# Altium schematic sheet MCU.SchDoc
size A4
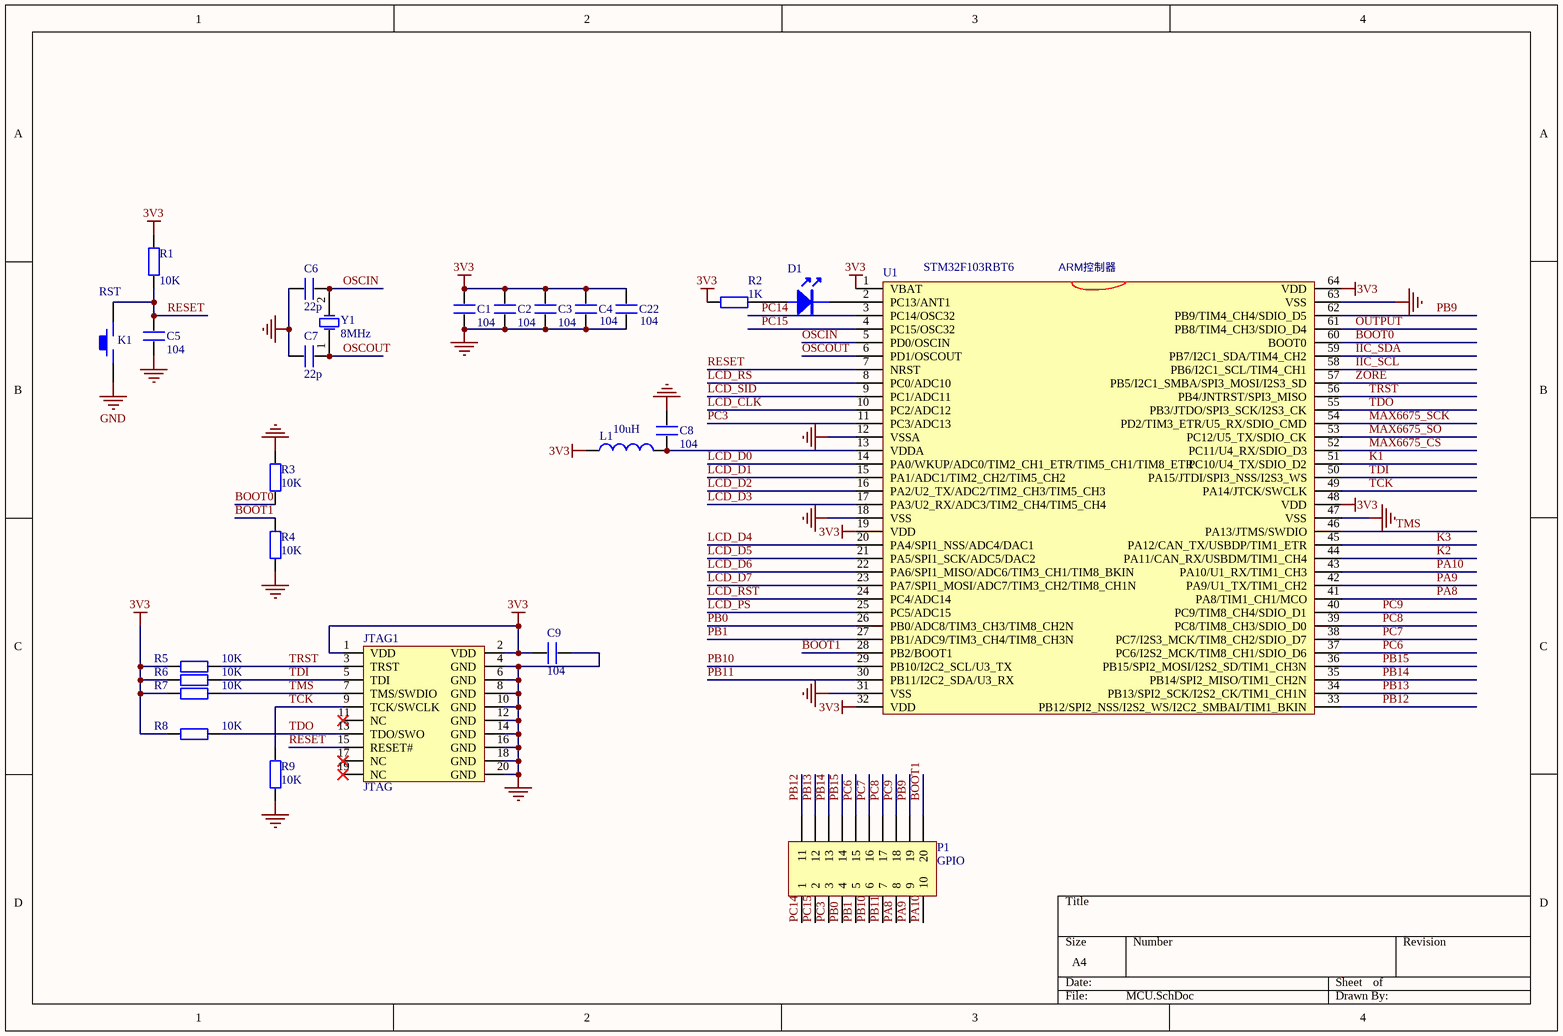
[diagram p0: MCU.SchDoc]

## Parts
C1  104  [1206]
C2  104  [1206]
C3  104  [1206]
C4  104  [1206]
C5  104  [1206]
C6  22p  [1206]
C7  22p  [1206]
C8  104  [1206]
C9  104  [1206]
C22  104  [1206]
D1  (no value)  [LED]
JTAG1  JTAG  [JTAG_20]
K1  RST  [KEY_M]
L1  10uH  [1206]
P1  GPIO  [HDR2X10_CEN]
R1  value 10K  [1206]
R2  1K  [1206]
R3  10K  [1206]
R4  10K  [1206]
R5  10K  [1206]
R6  10K  [1206]
R7  10K  [1206]
R8  10K  [1206]
R9  10K  [1206]
U1  STM32F103RBT6  [LQFP64]
Y1  8MHz  [XTAL_US]

## Nets
3V3: C1.1 C2.1 C3.1 C4.1 C9.1 C22.1 JTAG1.1(VDD) JTAG1.2(VDD) L1.1 R1.1 R2.1 R5.1 R6.2 R7.2 R8.2 U1.1(VBAT) U1.19(VDD) U1.32(VDD) U1.48(VDD) U1.64(VDD)
GND: C1.2 C2.2 C3.2 C4.2 C5.2 C6.2 C7.1 C8.1 C9.2 C22.2 JTAG1.4(GND) JTAG1.6(GND) JTAG1.8(GND) JTAG1.10(GND) JTAG1.12(GND) JTAG1.14(GND) JTAG1.16(GND) JTAG1.18(GND) JTAG1.20(GND) K1.1 R3.2 R4.1 R9.1 U1.12(VSSA) U1.18(VSS) U1.31(VSS) U1.47(VSS) U1.63(VSS)
BOOT0: R3.1 U1.60(BOOT0)
BOOT1: P1.20 R4.2 U1.28(PB2/BOOT1)
IIC_SCL: U1.58(PB6/I2C1_SCL/TIM4_CH1)
IIC_SDA: U1.59(PB7/I2C1_SDA/TIM4_CH2)
K1: U1.51(PC10/U4_TX/SDIO_D2)
K2: U1.44(PA11/CAN_RX/USBDM/TIM1_CH4)
K3: U1.45(PA12/CAN_TX/USBDP/TIM1_ETR)
LCD_CLK: U1.10(PC2/ADC12)
LCD_D0: U1.14(PA0/WKUP/ADC0/TIM2_CH1_ETR/TIM5_CH1/TIM8_ETR)
LCD_D1: U1.15(PA1/ADC1/TIM2_CH2/TIM5_CH2)
LCD_D2: U1.16(PA2/U2_TX/ADC2/TIM2_CH3/TIM5_CH3)
LCD_D3: U1.17(PA3/U2_RX/ADC3/TIM2_CH4/TIM5_CH4)
LCD_D4: U1.20(PA4/SPI1_NSS/ADC4/DAC1)
LCD_D5: U1.21(PA5/SPI1_SCK/ADC5/DAC2)
LCD_D6: U1.22(PA6/SPI1_MISO/ADC6/TIM3_CH1/TIM8_BKIN)
LCD_D7: U1.23(PA7/SPI1_MOSI/ADC7/TIM3_CH2/TIM8_CH1N)
LCD_PS: U1.25(PC5/ADC15)
LCD_RS: U1.8(PC0/ADC10)
LCD_RST: U1.24(PC4/ADC14)
LCD_SID: U1.9(PC1/ADC11)
MAX6675_CS: U1.52(PC11/U4_RX/SDIO_D3)
MAX6675_SCK: U1.54(PD2/TIM3_ETR/U5_RX/SDIO_CMD)
MAX6675_SO: U1.53(PC12/U5_TX/SDIO_CK)
OSCIN: C6.1 U1.5(PD0/OSCIN) Y1.2(OSC2)
OSCOUT: C7.2 U1.6(PD1/OSCOUT) Y1.1(OSC1)
OUTPUT: U1.61(PB8/TIM4_CH3/SDIO_D4)
PA8: P1.8 U1.41(PA8/TIM1_CH1/MCO)
PA9: P1.9 U1.42(PA9/U1_TX/TIM1_CH2)
PA10: P1.10 U1.43(PA10/U1_RX/TIM1_CH3)
PB0: P1.4 U1.26(PB0/ADC8/TIM3_CH3/TIM8_CH2N)
PB1: P1.5 U1.27(PB1/ADC9/TIM3_CH4/TIM8_CH3N)
PB9: P1.19 U1.62(PB9/TIM4_CH4/SDIO_D5)
PB10: P1.6 U1.29(PB10/I2C2_SCL/U3_TX)
PB11: P1.7 U1.30(PB11/I2C2_SDA/U3_RX)
PB12: P1.11 U1.33(PB12/SPI2_NSS/I2S2_WS/I2C2_SMBAI/TIM1_BKIN)
PB13: P1.12 U1.34(PB13/SPI2_SCK/I2S2_CK/TIM1_CH1N)
PB14: P1.13 U1.35(PB14/SPI2_MISO/TIM1_CH2N)
PB15: P1.14 U1.36(PB15/SPI2_MOSI/I2S2_SD/TIM1_CH3N)
PC3: P1.3 U1.11(PC3/ADC13)
PC6: P1.15 U1.37(PC6/I2S2_MCK/TIM8_CH1/SDIO_D6)
PC7: P1.16 U1.38(PC7/I2S3_MCK/TIM8_CH2/SDIO_D7)
PC8: P1.17 U1.39(PC8/TIM8_CH3/SDIO_D0)
PC9: P1.18 U1.40(PC9/TIM8_CH4/SDIO_D1)
PC14: P1.1 U1.3(PC14/OSC32)
PC15: P1.2 U1.4(PC15/OSC32)
RESET: C5.1 JTAG1.15(RESET#) K1.2 R1.2 U1.7(NRST)
TCK: JTAG1.9(TCK/SWCLK) R9.2 U1.49(PA14/JTCK/SWCLK)
TDI: JTAG1.5(TDI) R6.1 U1.50(PA15/JTDI/SPI3_NSS/I2S3_WS)
TDO: JTAG1.13(TDO/SWO) R8.1 U1.55(PB3/JTDO/SPI3_SCK/I2S3_CK)
TMS: JTAG1.7(TMS/SWDIO) R7.1 U1.46(PA13/JTMS/SWDIO)
TRST: JTAG1.3(TRST) R5.2 U1.56(PB4/JNTRST/SPI3_MISO)
ZORE: U1.57(PB5/I2C1_SMBA/SPI3_MOSI/I2S3_SD)
NetC8_2: C8.2 L1.2 U1.13(VDDA)
NetD1_A: D1.A R2.2
NetD1_K: D1.K U1.2(PC13/ANT1)

Not connected (* = marked no-connect by the designer): JTAG1 11(NC)* 17(NC)* 19(NC)*

## Notes on the sheet
- (near U1) ARM控制器

## Library data of the parts
C1-C9 C22 = C
D1 = 发光二极管
K1 = KEY_M
L1 = Inductor: Code_IEC: 1005; Published: 8-Jun-2000; LatestRevisionDate: 29-May-2009; LatestRevisionNote: IPC-7351 Footprint Added.; PackageReference: 0402-A; Publisher: Altium Limited; PackageDescription: Chip Inductor; Code_JEITA: 0402
P1 = Header 10X2A: Header, 10-Pin, Dual row; LatestRevisionDate: 17-Jul-2002; LatestRevisionNote: Re-released for DXP Platform.; Publisher: Altium Limited
R1 R3-R6 R8 R9 = Res2: Resistor; Published: 8-Jun-2000; LatestRevisionDate: 17-Jul-2002; LatestRevisionNote: Re-released for DXP Platform.; PackageReference: AXIAL-0.4; Publisher: Altium Limited; PackageDescription: Axial Device, Thru-Hole; 2 Leads; 0.4 in Pin Spacing
  R3-R6 R8 R9: Value: 10K
R2 = Res2: Resistor; Value: 10K; Published: 8-Jun-2000; LatestRevisionDate: 17-Jul-2002; LatestRevisionNote: Re-released for DXP Platform.; PackageReference: AXIAL-0.4; Publisher: Altium Limited; PackageDescription: Axial Device, Thru-Hole; 2 Leads; 0.4 in Pin Spacing
R7 = Res2: Resistor; Rule: PcbType=ProtelPcb; Published: 8-Jun-2000; LatestRevisionDate: 17-Jul-2002; LatestRevisionNote: Re-released for DXP Platform.; PackageReference: AXIAL-0.4; Publisher: Altium Limited; PackageDescription: Axial Device, Thru-Hole; 2 Leads; 0.4 in Pin Spacing; Value: 10K
U1 = STM32F103RDT6
Y1 = XTAL: Crystal Oscillator; Published: 8-Jun-2000; LatestRevisionDate: 17-Jul-2002; LatestRevisionNote: Re-released for DXP Platform.; Publisher: Altium Limited